# EAGLE design transmisorPCB_2.1 (EAGLE 7.6.0)
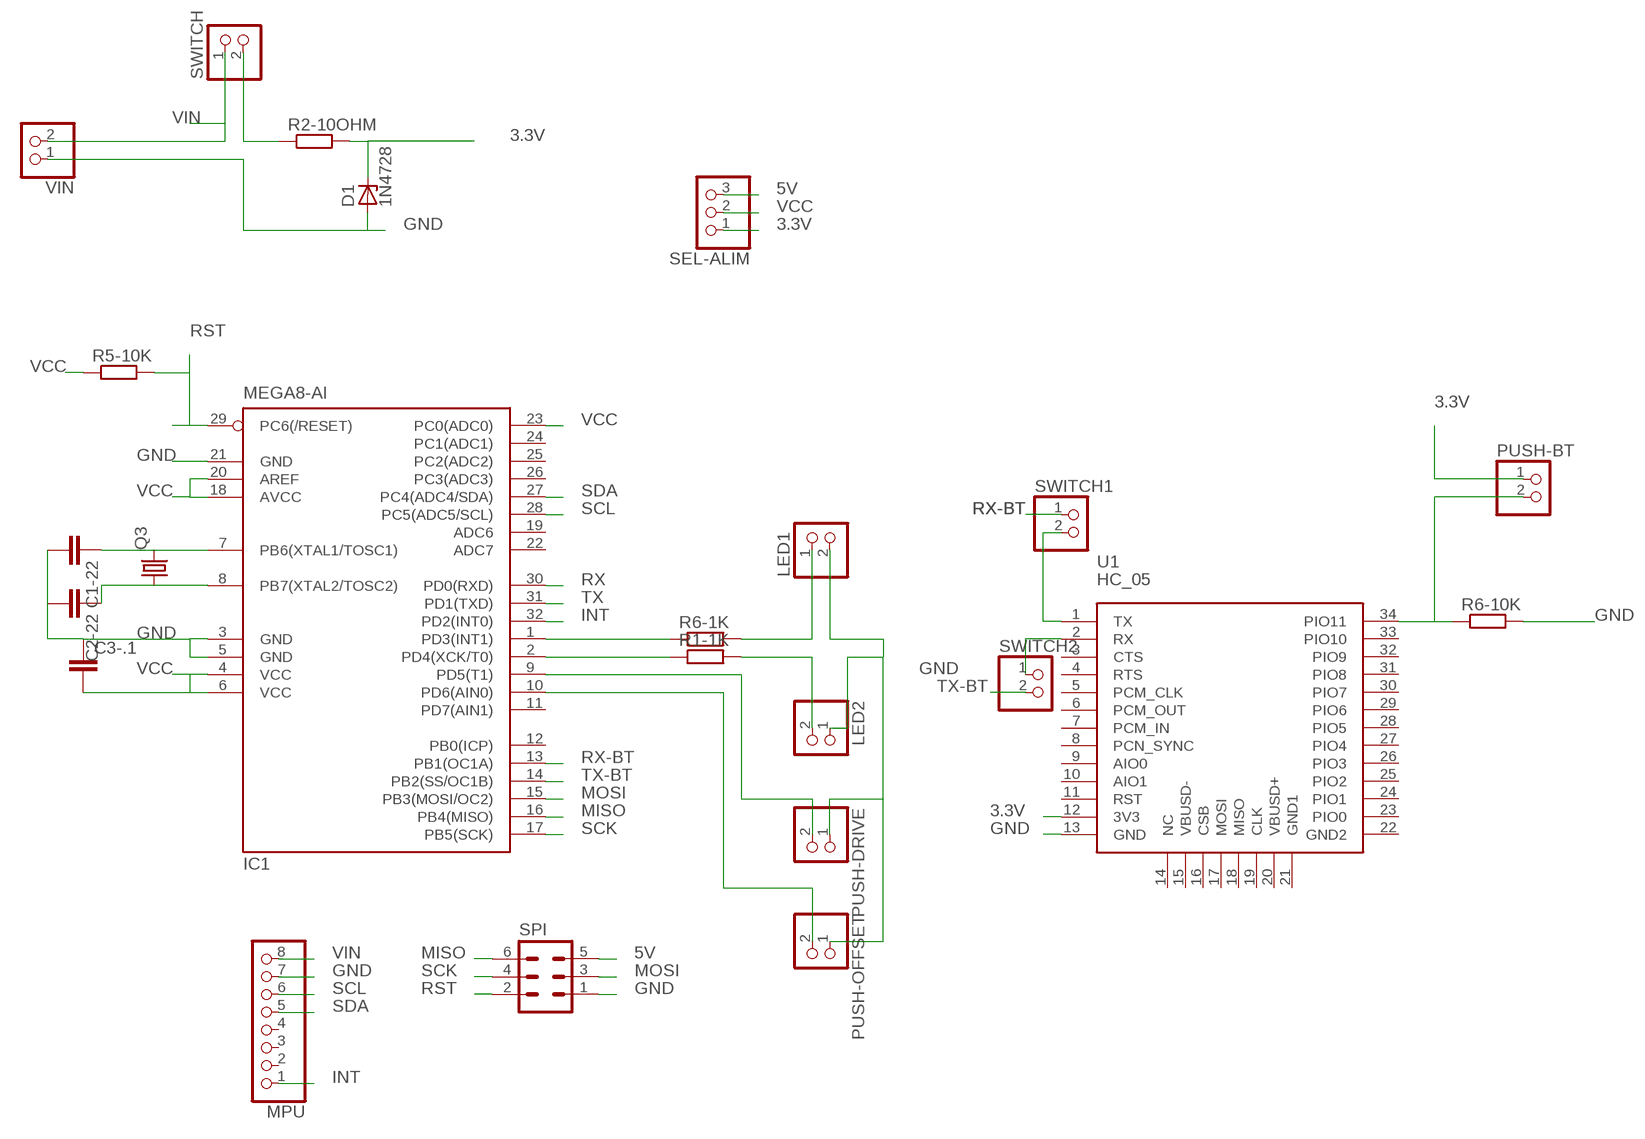
[diagram p0: schematic, sheet 1]

## Parts
C1-22  C-EUC0402K  [C0402K]
C2-22  C-EUC0402K  [C0402K]
C3-.1  C-EUC0402K  [C0402K]
D1  1N4728  [DO41Z10]
IC1  MEGA8-AI  [TQFP32-08]
LED1  PINHD-1X2  [1X02]
LED2  PINHD-1X2  [1X02]
MPU  PINHD-1X8  [1X08]
PUSH-BT  PINHD-1X2  [1X02]
PUSH-DRIVE  PINHD-1X2  [1X02]
PUSH-OFFSET  PINHD-1X2  [1X02]
Q3  CRYSTALHC49U70  [HC49U70]
R1-1K  R-EU_M1206  [M1206]
R2-10OHM  R-EU_R2512  [R2512]
R5-10K  R-EU_M1206  [M1206]
R6-1K  R-EU_M1206  [M1206]
R6-10K  R-EU_M1206  [M1206]
SEL-ALIM  PINHD-1X3  [1X03]
SPI  MA03-2  [MA03-2]
SWITCH  PINHD-1X2  [1X02]
SWITCH1  PINHD-1X2  [1X02]
SWITCH2  PINHD-1X2  [1X02]
U1  HC_05  [BLUETOOTH_SMD]
VIN  PINHD-1X2  [1X02]

## Nets
3.3V: D1.C PUSH-BT.1 R2-10OHM.2 SEL-ALIM.1 U1.12(3V3)
5V: SEL-ALIM.3 SPI.5
GND: C1-22.2 C2-22.2 C3-.1.1 D1.A IC1.3(GND) IC1.5(GND) IC1.21(GND) LED1.2 LED2.1 MPU.7 PUSH-DRIVE.1 PUSH-OFFSET.1 R6-10K.2 SPI.1 U1.13(GND) VIN.1
INT: IC1.32(PD2(INT0)) MPU.1
MISO: IC1.16(PB4(MISO)) SPI.6
MOSI: IC1.15(PB3(MOSI/OC2)) SPI.3
N$2: SWITCH2.1 U1.2(RX)
N$3: C1-22.1 IC1.7(PB6(XTAL1/TOSC1)) Q3.2
N$4: C2-22.1 IC1.8(PB7(XTAL2/TOSC2)) Q3.1
N$5: IC1.1(PD3(INT1)) R6-1K.1
N$6: IC1.2(PD4(XCK/T0)) R1-1K.1
N$7: R2-10OHM.1 SWITCH.2
N$8: SWITCH1.2 U1.1(TX)
N$9: LED1.1 R6-1K.2
N$10: LED2.2 R1-1K.2
N$11: IC1.9(PD5(T1)) PUSH-DRIVE.2
N$12: PUSH-BT.2 R6-10K.1 U1.34(PIO11)
N$13: IC1.10(PD6(AIN0)) PUSH-OFFSET.2
RST: IC1.29(PC6(/RESET)) R5-10K.2 SPI.2
RX: IC1.30(PD0(RXD))
RX-BT: IC1.13(PB1(OC1A)) SWITCH1.1
SCK: IC1.17(PB5(SCK)) SPI.4
SCL: IC1.28(PC5(ADC5/SCL)) MPU.6
SDA: IC1.27(PC4(ADC4/SDA)) MPU.5
TX: IC1.31(PD1(TXD))
TX-BT: IC1.14(PB2(SS/OC1B)) SWITCH2.2
VCC: C3-.1.2 IC1.4(VCC) IC1.6(VCC) IC1.18(AVCC) IC1.20(AREF) IC1.23(PC0(ADC0)) R5-10K.1 SEL-ALIM.2
VIN: MPU.8 SWITCH.1 VIN.2
Unconnected: IC1.11(PD7(AIN1)) IC1.12(PB0(ICP)) IC1.19(ADC6) IC1.22(ADC7) IC1.24(PC1(ADC1)) IC1.25(PC2(ADC2)) IC1.26(PC3(ADC3)) MPU.2 MPU.3 MPU.4 U1.3(CTS) U1.4(RTS) U1.5(PCM_CLK) U1.6(PCM_OUT) U1.7(PCM_IN) U1.8(PCN_SYNC) U1.9(AIO0) U1.10(AIO1) U1.11(RST) U1.14(NC) U1.15(VBUSD-) U1.16(CSB) U1.17(MOSI) U1.18(MISO) U1.19(CLK) U1.20(VBUSD+) U1.21(GND1) U1.22(GND2) U1.23(PIO0) U1.24(PIO1) U1.25(PIO2) U1.26(PIO3) U1.27(PIO4) U1.28(PIO5) U1.29(PIO6) U1.30(PIO7) U1.31(PIO8) U1.32(PIO9) U1.33(PIO10)

## Library data of the parts
C1-22 C2-22 C3-.1 = rcl:C-EU: CAPACITOR, European symbol
D1 = diode:1N4728: Z DIODE 3.3 V, 1W, 5 percent
IC1 = atmel:MEGA8: MICROCONTROLLER 8 Kbytes FLASH, 1 kbytes SRAM, 512 bytes EEPROM, USART, 6-channel 10 bit ADC, 2-channel 8 bit ADC Pin compatible with Atmega48, ATMega88, ATMega168 Source: avr.lbr; MPN: ATMEGA8-16AU; OC_FARNELL: 9171371; OC_NEWARK: 73M8863
LED1 LED2 PUSH-BT PUSH-DRIVE PUSH-OFFSET SWITCH SWITCH1 SWITCH2 VIN = pinhead:PINHD-1X2: PIN HEADER
MPU = pinhead:PINHD-1X8: PIN HEADER
Q3 = crystal:CRYSTAL: CRYSTAL; OC_FARNELL: unknown; OC_NEWARK: unknown
R1-1K R5-10K R6-1K R6-10K = rcl:R-EU_: RESISTOR, European symbol
R2-10OHM = resistor:R-EU_: RESISTOR, European symbol
SEL-ALIM = pinhead:PINHD-1X3: PIN HEADER
SPI = con-lstb:MA03-2: PIN HEADER; OC_FARNELL: unknown; OC_NEWARK: unknown
U1 = Bluetooth HC-05:HC_05: HC-05 Bluetooth Module

## Board
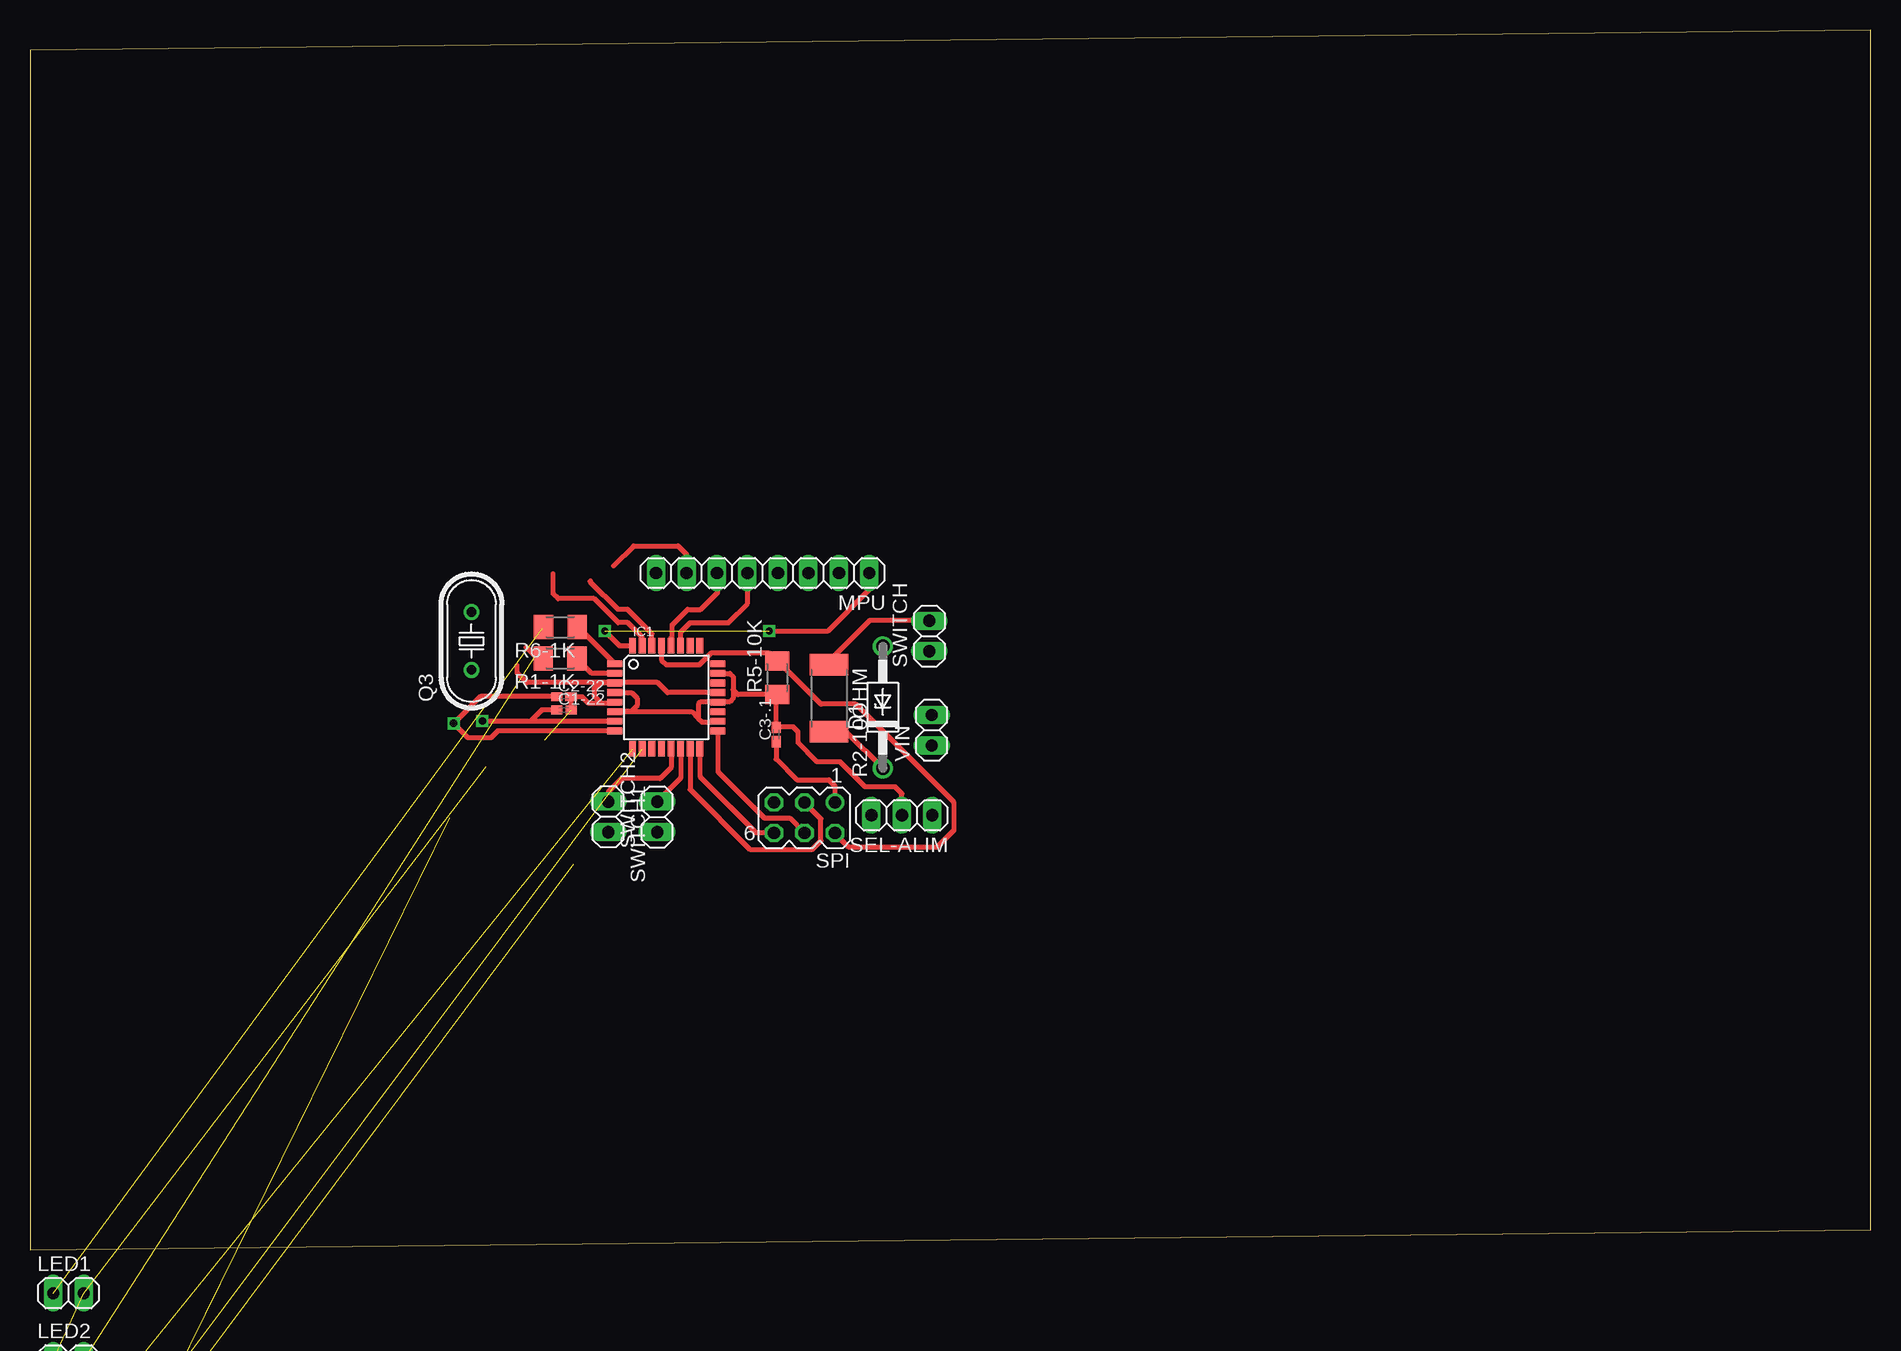
[diagram p1: board, top side]
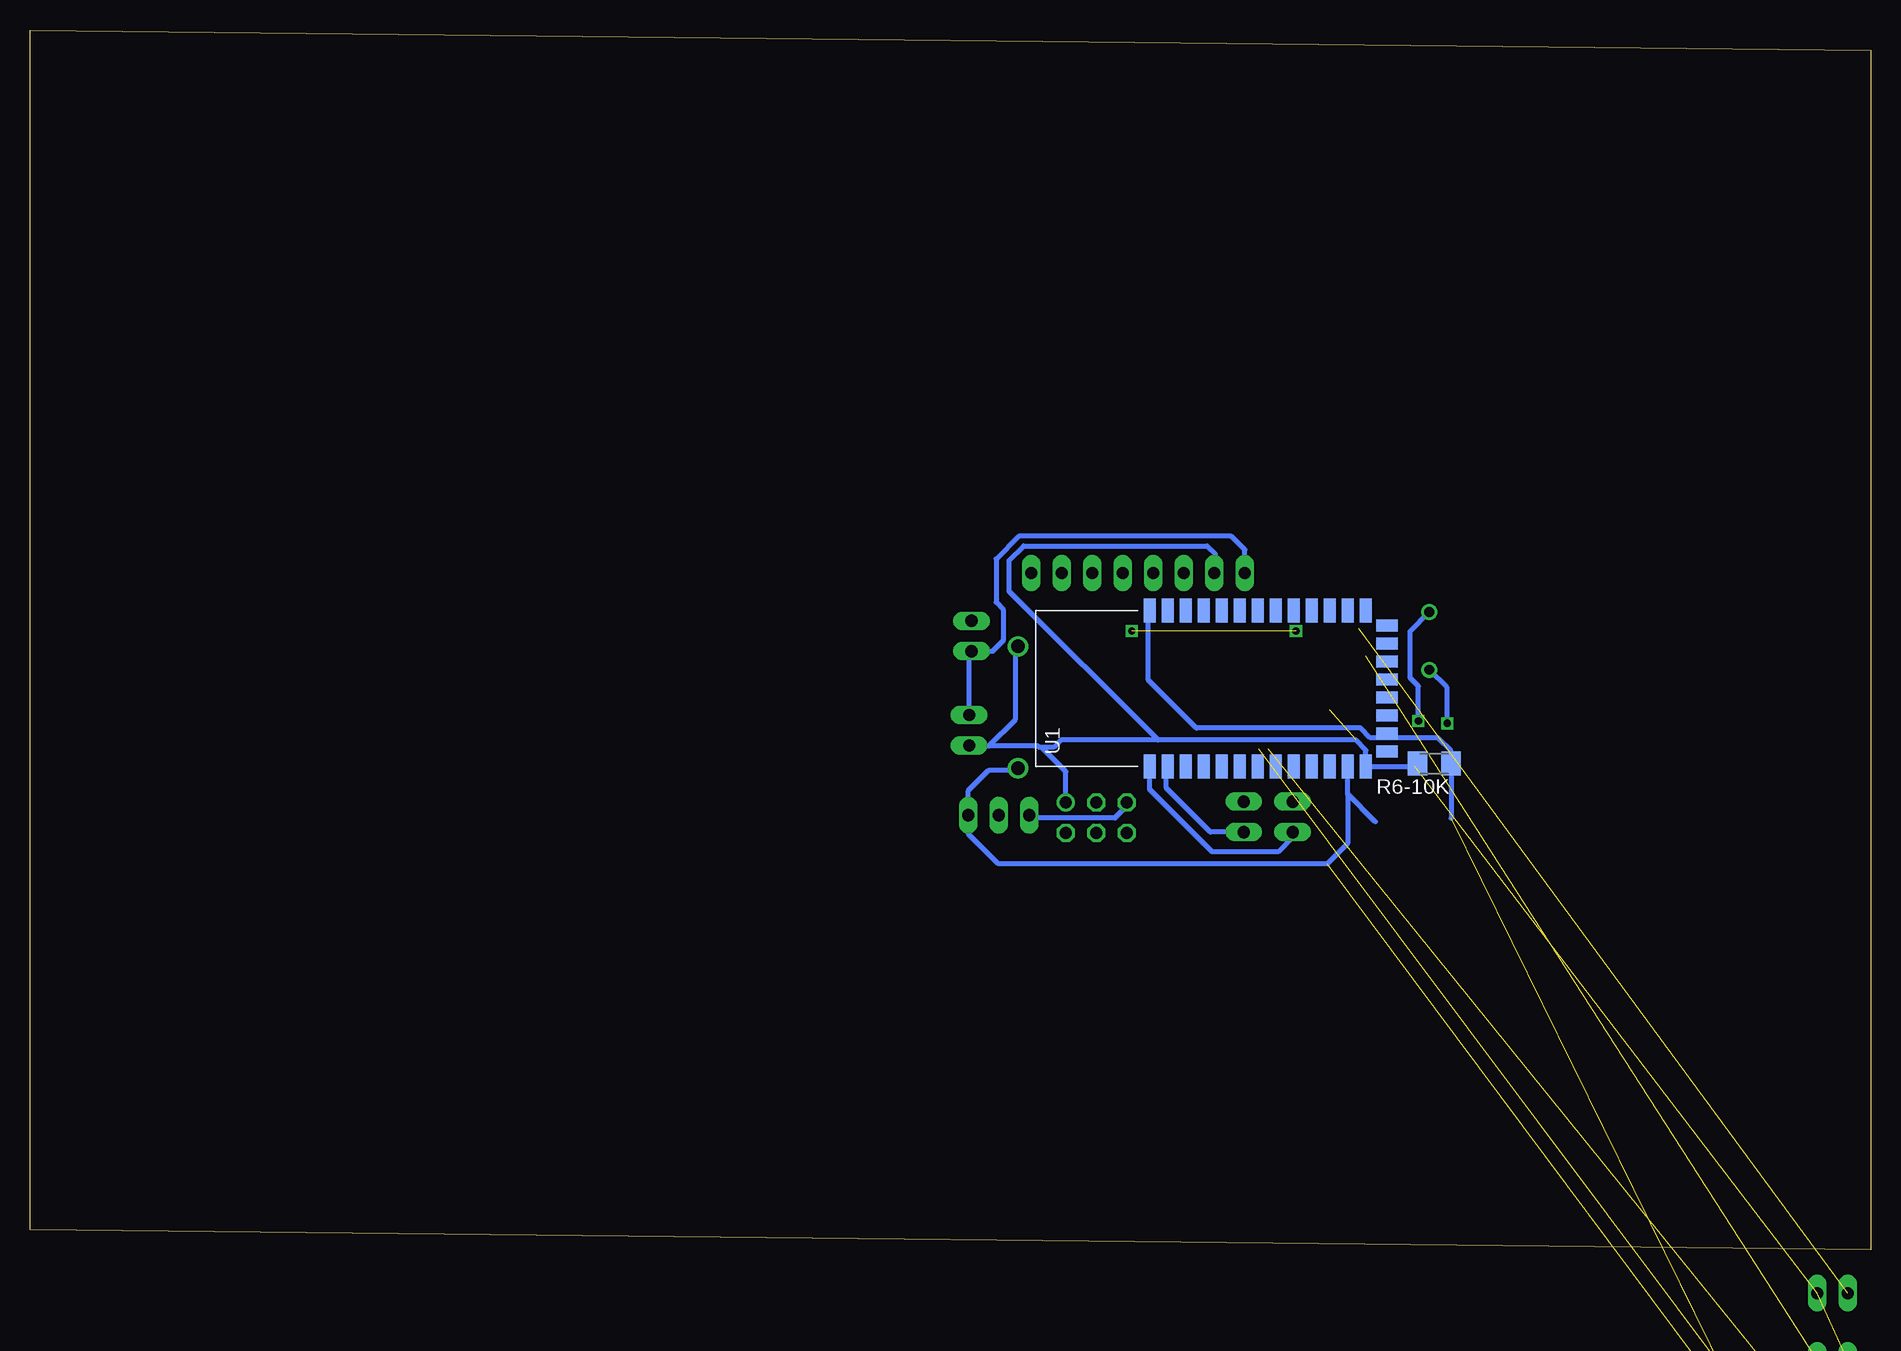
[diagram p2: board, bottom side, seen from below]

Size 153.4 x 101.7 mm. Coordinates in mm from the lower left corner, seen from the top.
Outline: 0,0 153.4,1.7 153.4,101.7 0,100 0,0
Copper layers (1*16): Top 0.035mm / dielectric 1.5mm / Bottom 0.035mm
Design rules "default": minimum track width 10mil, minimum drill 24mil, track to track 8mil, track to pad 8mil, pad to pad 8mil, via to via 8mil, smd to smd 8mil, copper to edge 40mil, drill to drill 8mil, minimum pad ring 10mil, minimum via ring 8mil, stop-mask expansion 4mil, vias tented up to drill 0mil, thermal gap 10mil

### Footprints (pad centres in the part's own frame; a part is rotated, then mirrored left to right if it is on the bottom)
C0402K = smd 0.925 x 0.74: 1 -0.6,0; 2 0.6,0
DO41Z10 = drill 1.118: A 5.08,0; C -5.08,0
TQFP32-08 = smd 1.27 x 0.559: 1 -4.293,2.8; 2 -4.293,2; 3 -4.293,1.2; 4 -4.293,0.4; 5 -4.293,-0.4; 6 -4.293,-1.2; 7 -4.293,-2; 8 -4.293,-2.8; 17 4.293,-2.8; 18 4.293,-2; 19 4.293,-1.2; 20 4.293,-0.4; 21 4.293,0.4; 22 4.293,1.2; 23 4.293,2; 24 4.293,2.8 | smd 0.559 x 1.27: 9 -2.8,-4.293; 10 -2,-4.293; 11 -1.2,-4.293; 12 -0.4,-4.293; 13 0.4,-4.293; 14 1.2,-4.293; 15 2,-4.293; 16 2.8,-4.293; 25 2.8,4.293; 26 2,4.293; 27 1.2,4.293; 28 0.4,4.293; 29 -0.4,4.293; 30 -1.2,4.293; 31 -2,4.293; 32 -2.8,4.293
1X02 = drill 1.016 long: 1 -1.27,0; 2 1.27,0
1X08 = drill 1.016 long: 1 -8.89,0; 2 -6.35,0; 3 -3.81,0; 4 -1.27,0; 5 1.27,0; 6 3.81,0; 7 6.35,0; 8 8.89,0
HC49U70 = drill 0.813: 1 -2.413,0; 2 2.413,0
M1206 = smd 1.6 x 2: 1 -1.4,0; 2 1.4,0
R2512 = smd 1.8 x 3.2: 1 -2.8,0; 2 2.8,0
1X03 = drill 1.016 long: 1 -2.54,0; 2 0,0; 3 2.54,0
MA03-2 = drill 1.016: 1 -2.54,-1.27 | drill 1.016 octagon: 2 -2.54,1.27; 3 0,-1.27; 4 0,1.27; 5 2.54,-1.27; 6 2.54,1.27
BLUETOOTH_SMD = smd 2 x 1: 1 -6.35,3.81; 2 -6.35,2.31; 3 -6.35,0.81; 4 -6.35,-0.69; 5 -6.35,-2.19; 6 -6.35,-3.69; 7 -6.35,-5.19; 8 -6.35,-6.69; 9 -6.35,-8.19; 10 -6.35,-9.69; 11 -6.35,-11.19; 12 -6.35,-12.69; 13 -6.35,-14.19; 22 6.65,-14.19; 23 6.65,-12.69; 24 6.65,-11.19; 25 6.65,-9.69; 26 6.65,-8.19; 27 6.65,-6.69; 28 6.65,-5.19; 29 6.65,-3.69; 30 6.65,-2.19; 31 6.65,-0.69; 32 6.65,0.81; 33 6.65,2.31; 34 6.65,3.81 | smd 1 x 1.8: 14 -5.1,-15.94; 15 -3.6,-15.94; 16 -2.1,-15.94; 17 -0.6,-15.94; 18 0.9,-15.94; 19 2.4,-15.94; 20 3.9,-15.94; 21 5.4,-15.94

### Placement (x,y rotation side)
C1-22  44.49,45.02 0 top
C2-22  44.48,46.12 0 top
C3-.1  62.18,42.97 90 top
D1  71.07,45.24 90 top
IC1  53.02,46.07 0 top
LED1  3.2,-3.6 0 top  (outside the outline)
LED2  3.2,-9.2 0 top  (outside the outline)
MPU  61.06,56.43 180 top
PUSH-BT  3.2,-26 0 top  (outside the outline)
PUSH-DRIVE  3.2,-14.8 0 top  (outside the outline)
PUSH-OFFSET  3.2,-20.4 0 top  (outside the outline)
Q3  36.79,50.77 90 top
R1-1K  44.18,49.31 180 top
R2-10OHM  66.59,46 270 top
R5-10K  62.26,47.7 90 top
R6-1K  44.2,51.91 180 top
R6-10K  36.38,40.54 180 bottom
SEL-ALIM  72.66,36.24 180 top
SPI  64.54,36.03 180 top
SWITCH  74.94,51.18 90 top
SWITCH1  48.18,36.1 270 top
SWITCH2  52.26,36.1 90 top
U1  56.26,46.67 90 bottom
VIN  75.14,43.33 90 top

### Tracks (layer width: path | path; a pad name or v marks a point on that pad's centre or on a via)
3.3V  (1 unrouted)
  Top 0.406: R2-10OHM.2 68.03,43.2 D1.C
  Bottom 0.406: 41.29,35.69 43.6,38 | 43.6,38 43.6,40.29 U1.12 | D1.C 71.23,40 73.5,40 75.2,38.3 SEL-ALIM.1 75.2,34.7 72.7,32.2 45.3,32.2 43.6,33.9 43.6,38
5V
  Bottom 0.406: SPI.5 62,37 63,36 69.88,36 SEL-ALIM.3
GND  (5 unrouted)
  Top 0.406: IC1.21 53.13,46.47 52.3,47.3 48.76,47.3 | 48.76,47.3 IC1.3 47.47,47.27 47,46.8 47,46.2 47.6,45.6 | C1-22.2 C2-22.2 45.98,46.12 46.5,45.6 47.6,45.6 | 47.6,45.6 48.66,45.6 IC1.5 | 48.76,47.3 41.4,47.3 40.6,48.1 40.6,48.73 | 48.64,57.04 50.3,58.7 54,58.7 54.7,58 MPU.7 | C3-.1.1 62.18,40.92 63.9,39.2 66.58,39.2 67.08,38.7 SPI.1
  Bottom 0.406: R6-10K.2 38,40.32 U1.13 42.07,41.67 42.9,42.5 59.4,42.5 | 73.5,42 69.4,42 69.3,41.9 69.1,41.9 | 73.5,42 75.08,42 VIN.1 | 59.4,42.5 67.5,42.5 68.1,41.9 69.1,41.9 | D1.A 71.3,50.1 71.3,44.2 73.5,42 | 59.4,42.5 71.8,54.9 71.8,57.5 70.6,58.7 55.3,58.7 54.65,58.05 54.65,56.49 MPU.7 | SPI.1 67.08,39.88 69.1,41.9
INT  (via drill 0.6)  (1 unrouted)
  Top 0.406: IC1.32 49.14,50.36 v47.9,51.6 | v61.6,51.6 66.5,51.6 69.9,55 69.9,56.38 MPU.1
MISO
  Top 0.406: IC1.16 55.82,39.48 60.5,34.8 61.96,34.8 SPI.6
MOSI
  Top 0.406: IC1.15 55.02,38.38 60,33.4 65.2,33.4 65.9,34.1 65.9,35.94 SPI.3
N$2
  Bottom 0.406: SWITCH2.1 55.03,34.83 58.7,38.5 58.7,40.19 U1.2
N$3  (via drill 0.6)
  Top 0.406: IC1.7 41.7,44.07 | 41.7,44.07 37.73,44.07 v37.7,44.1 | C1-22.1 42.65,45.02 41.7,44.07
  Bottom 0.406: v37.7,44.1 37.7,47 38.4,47.7 38.4,51.57 Q3.2
N$4  (via drill 0.6)
  Top 0.406: IC1.8 38.97,43.27 38.4,42.7 36.5,42.7 v35.3,43.9 37.52,46.12 C2-22.1
  Bottom 0.406: v35.3,43.9 35.3,46.87 Q3.1
N$5
  Top 0.406: R6-1K.1 45.69,51.91 IC1.1
N$6
  Top 0.406: IC1.2 46.82,48.07 R1-1K.1
N$7
  Top 0.406: R2-10OHM.1 66.59,49.09 70,52.5 74.89,52.5 SWITCH.2
N$8
  Bottom 0.406: SWITCH1.2 48.18,34.42 49.4,33.2 54.9,33.2 60.1,38.4 60.1,40.29 U1.1
N$9  (1 unrouted)
  Top 0.406: 42.69,51.8 R6-1K.2
N$10  (1 unrouted)
  Top 0.406: 41.35,50.25 42.1,49.5 42.59,49.5 R1-1K.2
N$11  (1 unrouted)
N$12  (1 unrouted)
  Bottom 0.406: 34.98,36 R6-10K.1 34.98,41.58 36.1,42.7 41.7,42.7 42.5,43.5 56.2,43.5 60.2,47.5 60.2,53.19 U1.34
N$13  (1 unrouted)
RST
  Top 0.406: IC1.29 52.62,49.18 53,48.8 55.8,48.8 56.8,49.8 61.56,49.8 R5-10K.2 62.96,48.4 63,48.4 65.9,45.5 68.8,45.5 77,37.3 77,35 75.6,33.6 68.2,33.6 67.08,34.72 SPI.2
RX
  Top 0.406: IC1.30 51.82,51.38 49.8,53.4 49,53.4 46.7,55.7 46.7,55.8
RX-BT
  Top 0.406: IC1.13 53.42,40.22 52.5,39.3 49.3,39.3 48.2,38.2 48.2,37.39 SWITCH1.1
SCK
  Top 0.406: IC1.17 57.31,39.89 61.2,36 63.3,36 SPI.4
SCL
  Top 0.406: IC1.28 53.42,51.02 53.5,51.1 53.5,52.1 54.8,53.4 55.9,53.4 57.3,54.8 57.3,56.38 MPU.6
SDA
  Top 0.406: IC1.27 54.22,51.52 55,52.3 58.2,52.3 59.8,53.9 MPU.5
TX
  Top 0.406: IC1.31 51.02,51.08 49.8,52.3 49,52.3 47,54.3 44,54.3 43.6,54.7 43.6,56.36
TX-BT
  Top 0.406: IC1.14 54.22,39.33 SWITCH2.2
VCC
  Top 0.406: IC1.23 58.33,48.07 58.6,47.8 58.6,46.7 | 58.6,46.7 58.6,46 58.3,45.7 57.34,45.7 IC1.20 55.87,45.67 55.7,45.5 55.7,44.3 | 55.7,44.3 56,44 57.24,44 IC1.18 | IC1.4 50.13,46.47 50.6,46 50.6,45.4 50.1,44.9 48.76,44.9 IC1.6 55.13,44.87 55.7,44.3 | 58.6,46.7 59,46.3 R5-10K.1 62.18,46.22 C3-.1.2 62.21,43.6 63.6,43.6 64,43.2 64,42.3 65.6,40.7 67.5,40.7 69.6,38.6 72.1,38.6 72.66,38.04 SEL-ALIM.2
VIN
  Bottom 0.406: VIN.2 75.14,49.71 SWITCH.1 73.2,49.9 72.3,50.8 72.3,53.4 72.9,54 72.9,57.6 71,59.5 53.3,59.5 52.17,58.37 MPU.8